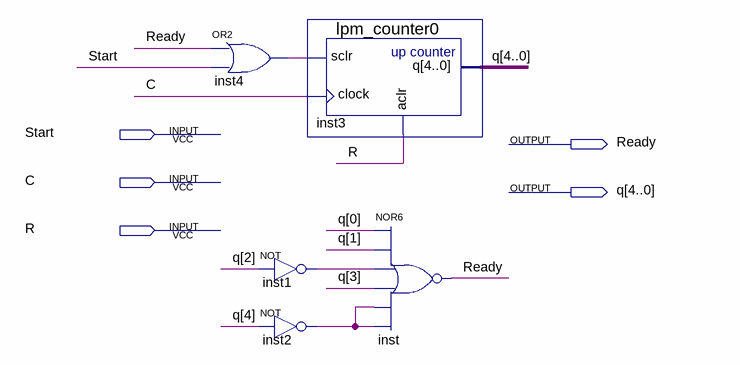
[diagram p0: schematic sheet]
// Quartus schematic count_cycle.bdf as structural Verilog: 5 symbols, 5 pins
module count_cycle (
  input  Start,
  input  C,
  input  R,
  output Ready,
  output [4:0] q
);

  wire inst1_out, inst2_out, inst4_out;

  or inst4 (inst4_out, Ready, Start);
  lpm_counter0 inst3 (.sclr(inst4_out), .clock(C), .aclr(R), .q(q));
  not inst1 (inst1_out, q[2]);
  not inst2 (inst2_out, q[4]);
  nor inst (Ready, q[0], q[1], inst1_out, q[3], inst2_out, inst2_out);
endmodule
